# Altium project STM32MINI.PrjPcb
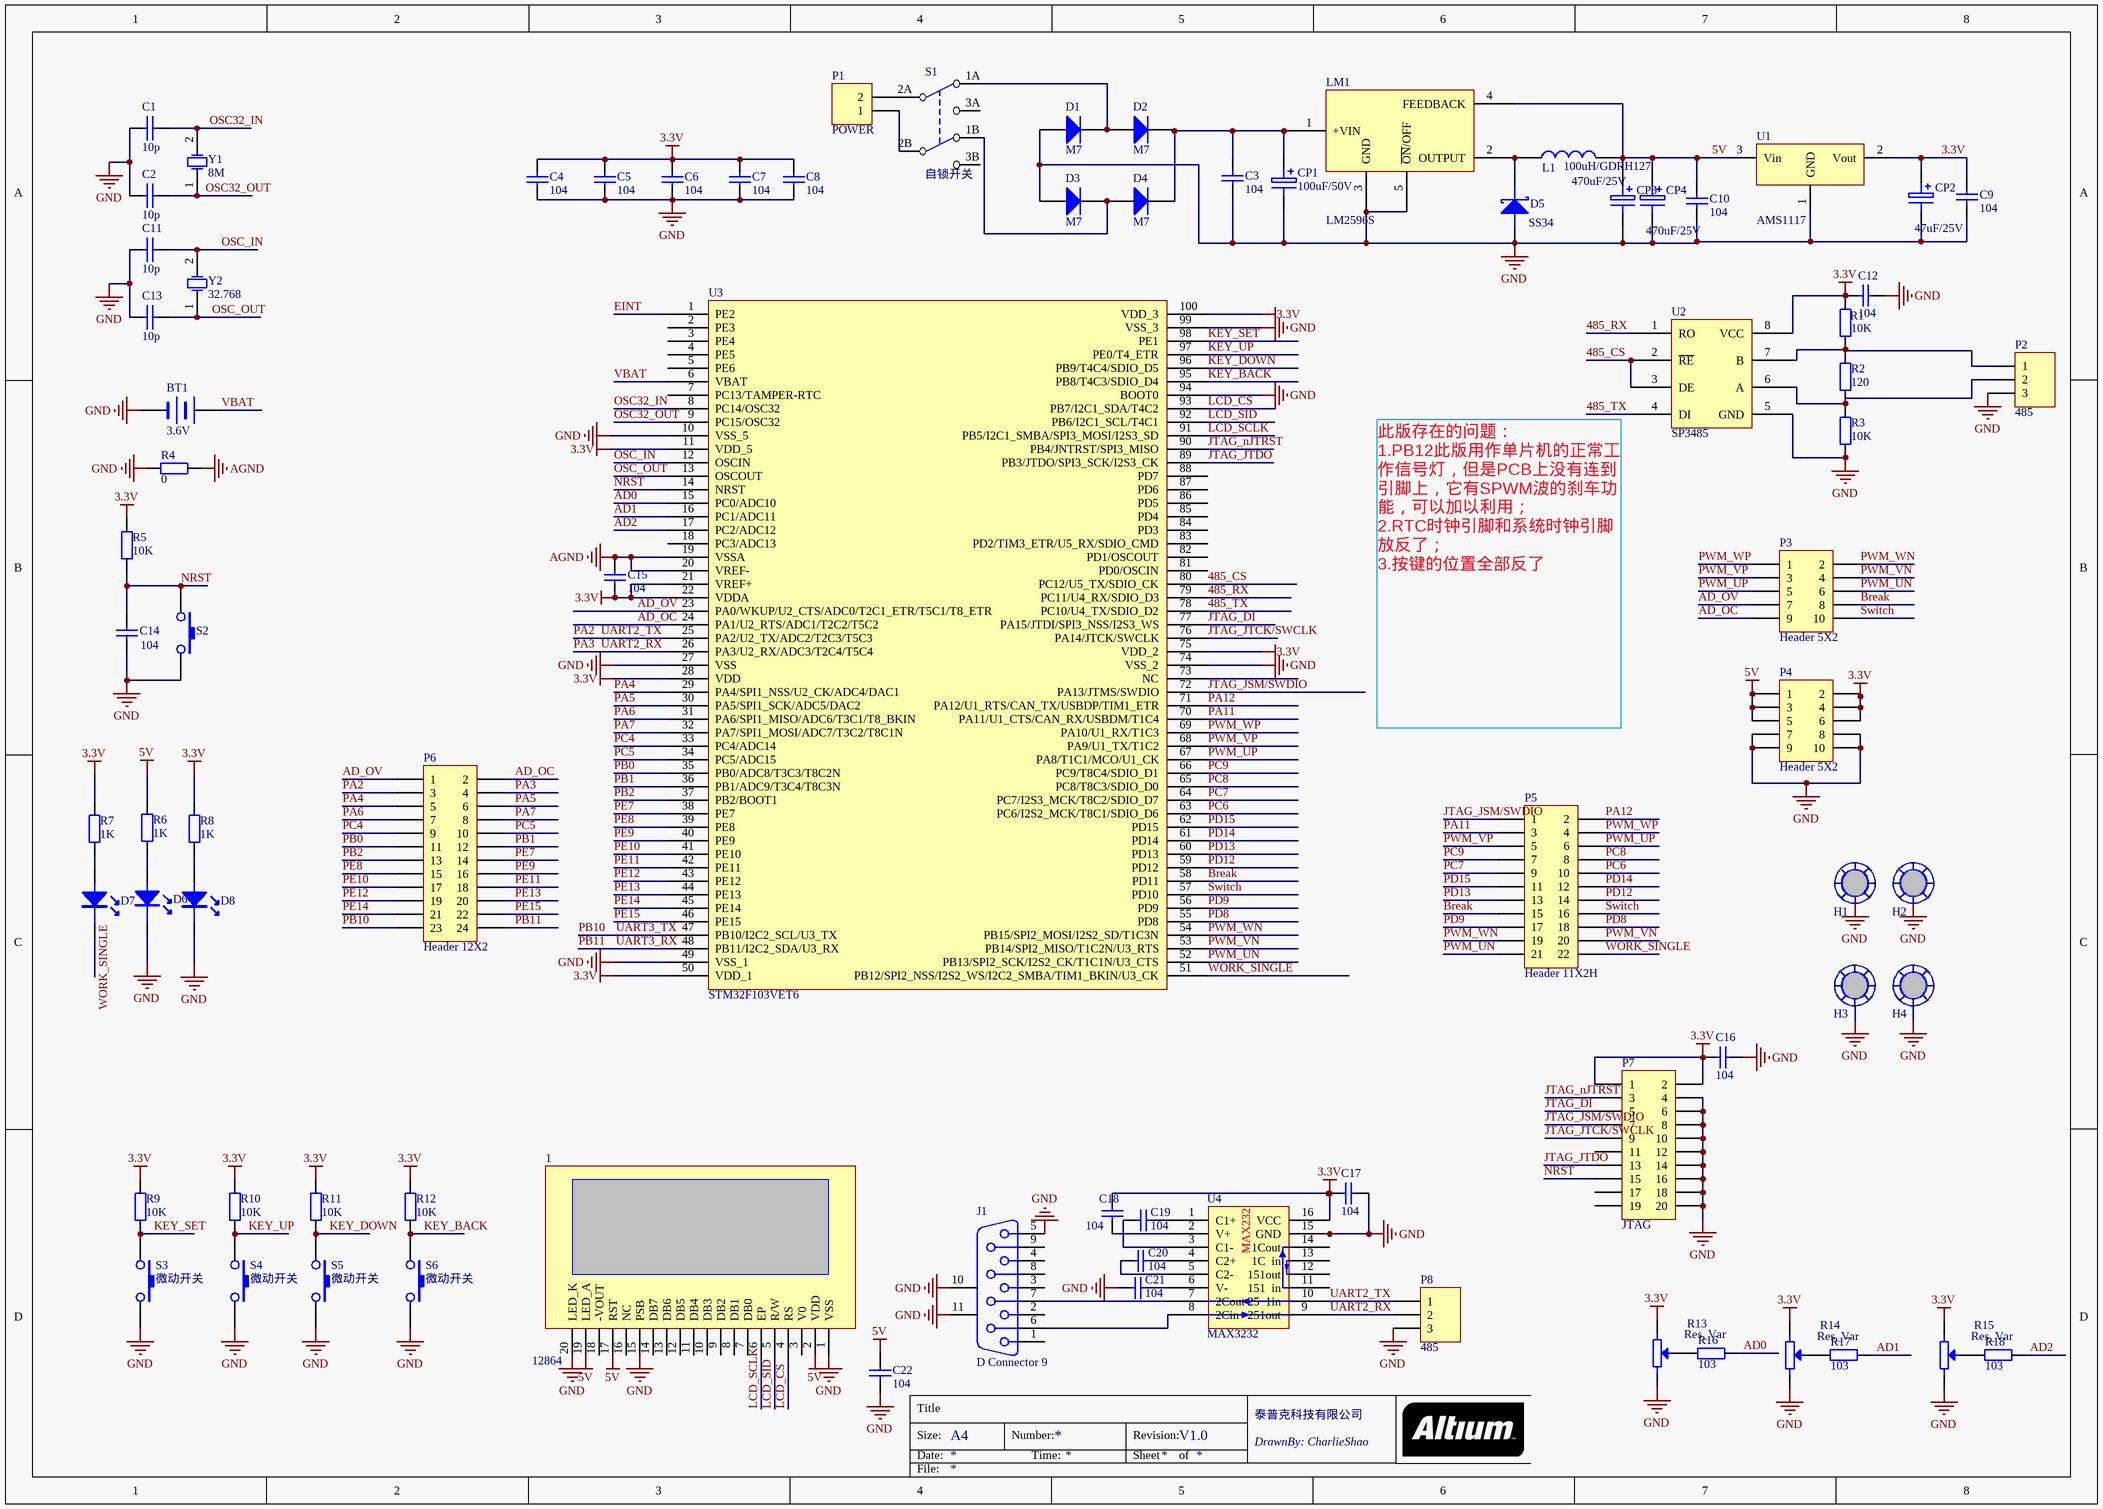
[diagram p0: MCU外围电路.SchDoc]
1 sheet, 81 parts. Net scope: global (net labels, ports and power ports of the same name join across sheets).
Board file: STM32MINI.PcbDoc

## Sheet MCU外围电路.SchDoc
size A3; Address1: 泰普克科技有限公司; Address3: DrawnBy: CharlieShao; Revision: V1.0; ProjectName: BPQ

### Parts
1  12864  [YX12864B]
BT1  3.6V  [CR1220]
C1  10p  [0805C]
C2  10p  [0805C]
C3  104  [0805C]
C4  104  [0805C]
C5  104  [0805C]
C6  104  [0805C]
C7  104  [0805C]
C8  104  [0805C]
C9  104  [0805C]
C10  104  [0805C]
C11  10p  [0805C]
C12  104  [0805C]
C13  10p  [0805C]
C14  104  [0805C]
C15  104  [0805C]
C16  104  [0805C]
C17  104  [0805C]
C18  104  [0805C]
C19  104  [0805C]
C20  104  [0805C]
C21  104  [0805C]
C22  104  [0805C]
CP1  100uF/50V  [CAP_8X105]
CP2  47uF/25V  [CAP_6.3X5.4]
CP3  470uF/25V  [CAP_10X105]
CP4  470uF/25V  [CAP_10X105]
D1  M7  [SMA]
D2  M7  [SMA]
D3  M7  [SMA]
D4  M7  [SMA]
D5  SS34  [SMC]
D6  LED  [LED_0805]  (value not drawn)
D7  LED  [LED_0805]  (value not drawn)
D8  LED  [LED_0805]  (value not drawn)
H1  铜柱孔  [HOLE]  (value not drawn)
H2  铜柱孔  [HOLE]  (value not drawn)
H3  铜柱孔  [HOLE]  (value not drawn)
H4  铜柱孔  [HOLE]  (value not drawn)
J1  D Connector 9  [DSUB1.385-2H9]
L1  100uH/GDRH127  [SMDRH124/125/127]
LM1  LM2596S  [TO-263S]
P1  POWER  [3.81-2]
P2  485  [SIP3]
P3  Header 5X2  [HDR2X5]
P4  Header 5X2  [HDR2X5]
P5  Header 11X2H  [HDR2X11]
P6  Header 12X2  [HDR2X12]
P7  JTAG  [JTAG20]
P8  485  [SIP3]
R1  10K  [0805R]
R2  120  [0805R]
R3  10K  [0805R]
R4  0  [0805R]
R5  10K  [0805R]
R6  1K  [0805R]
R7  1K  [0805R]
R8  1K  [0805R]
R9  10K  [0805R]
R10  10K  [0805R]
R11  10K  [0805R]
R12  10K  [0805R]
R13  Res_Var  [VR1]
R14  Res_Var  [VR1]
R15  Res_Var  [VR1]
R16  103  [0805R]
R17  103  [0805R]
R18  103  [0805R]
S1  自锁开关  [自锁开关]
S2  KEY  [SW_PB - 6.5x4.5]  (value not drawn)
S3  微动开关  [SW_PB - 6.5x4.5]
S4  微动开关  [SW_PB - 6.5x4.5]
S5  微动开关  [SW_PB - 6.5x4.5]
S6  微动开关  [SW_PB - 6.5x4.5]
U1  AMS1117  [SOT223]
U2  SP3485  [SO-8]
U3  STM32F103VET6  [LQFP100]
U4  MAX3232  [SO-16]
Y1  8M  [XTAL2]
Y2  32.768  [XTAL1]

### Nets
3.3V: C4.1 C5.1 C6.1 C7.1 C8.1 C9.1 C12.1 C15.2 C16.1 C17.2 C18.2 CP2.1 P4.2 P4.4 P4.6 P7.1 P7.2 R1.2 R5.2 R7.1 R8.1 R9.2 R10.2 R11.2 R12.2 R13.1 R14.1 R15.1 U1.2(Vout) U2.8(VCC) U3.11(VDD_5) U3.21(VREF+) U3.22(VDDA) U3.28(VDD) U3.50(VDD_1) U3.75(VDD_2) U3.100(VDD_3) U4.16(VCC)
5V: 1.2(VDD) 1.17(RST) 1.19(LED_A) C10.1 C22.2 CP3.1 CP4.1 L1.2 LM1.4(FEEDBACK) P4.1 P4.3 P4.5 R6.1 U1.3(Vin)
AGND: C15.1 R4.1 U3.19(VSSA) U3.20(VREF-)
GND: 1.1(VSS) 1.15(PSB) 1.20(LED_K) BT1.2(-) C1.1 C2.1 C3.2 C4.2 C5.2 C6.2 C7.2 C8.2 C9.2 C10.2 C11.1 C12.2 C13.1 C14.1 C16.2 C17.1 C21.2 C22.1 CP1.2 CP2.2 CP3.2 CP4.2 D1.1(A) D3.1(A) D5.1(A) D6.2 D8.2 H1.0 H2.0 H3.0 H4.0 J1.5 J1.10(MH1) J1.11(MH2) LM1.3(GND) LM1.5(~{ON}/OFF) P2.3 P4.7 P4.8 P4.9 P4.10 P7.4 P7.6 P7.8 P7.10 P7.12 P7.14 P7.16 P7.18 P7.20 P8.3 R3.1 R4.2 R13.3 R14.3 R15.3 S2.2 S3.2 S4.2 S5.2 S6.2 U1.1(GND) U2.5(GND) U3.10(VSS_5) U3.27(VSS) U3.49(VSS_1) U3.74(VSS_2) U3.94(BOOT0) U3.99(VSS_3) U4.15(GND)
485_CS: U2.2(~{RE}) U2.3(DE) U3.80(PC12/U5_TX/SDIO_CK)
485_RX: U2.1(RO) U3.79(PC11/U4_RX/SDIO_D3)
485_TX: U2.4(DI) U3.78(PC10/U4_TX/SDIO_D2)
AD0: R16.1 U3.15(PC0/ADC10)
AD1: R17.1 U3.16(PC1/ADC11)
AD2: R18.1 U3.17(PC2/ADC12)
AD_OC: P3.9 P6.2 U3.24(PA1/U2_RTS/ADC1/T2C2/T5C2)
AD_OV: P3.7 P6.1 U3.23(PA0/WKUP/U2_CTS/ADC0/T2C1_ETR/T5C1/T8_ETR)
Break: P3.8 P5.15 U3.58(PD11)
EINT: U3.1(PE2)
JTAG_DI: P7.5 U3.77(PA15/JTDI/SPI3_NSS/I2S3_WS)
JTAG_JSM/SWDIO: P5.1 P7.7 U3.72(PA13/JTMS/SWDIO)
JTAG_JTCK/SWCLK: P7.9 U3.76(PA14/JTCK/SWCLK)
JTAG_JTDO: P7.13 U3.89(PB3/JTDO/SPI3_SCK/I2S3_CK)
JTAG_nJTRST: P7.3 U3.90(PB4/JNTRST/SPI3_MISO)
KEY_BACK: R12.1 S6.1 U3.95(PB8/T4C3/SDIO_D4)
KEY_DOWN: R11.1 S5.1 U3.96(PB9/T4C4/SDIO_D5)
KEY_SET: R9.1 S3.1 U3.98(PE1)
KEY_UP: R10.1 S4.1 U3.97(PE0/T4_ETR)
LCD_CS: 1.4(RS) U3.93(PB7/I2C1_SDA/T4C2)
LCD_SCLK: 1.6(EP) U3.91(PB5/I2C1_SMBA/SPI3_MOSI/I2S3_SD)
LCD_SID: 1.5(R/W) U3.92(PB6/I2C1_SCL/T4C1)
NRST: C14.2 P7.15 R5.1 S2.1 U3.14(NRST)
OSC32_IN: C1.2 U3.8(PC14/OSC32) Y1.2(OSC2)
OSC32_OUT: C2.2 U3.9(PC15/OSC32) Y1.1(OSC1)
OSC_IN: C11.2 U3.12(OSCIN) Y2.2(OSC2)
OSC_OUT: C13.2 U3.13(OSCOUT) Y2.1(OSC1)
PA2: P6.3 P8.1 U3.25(PA2/U2_TX/ADC2/T2C3/T5C3) U4.10(25__1in)  [also labelled UART2_TX]
PA3: P6.4 P8.2 U3.26(PA3/U2_RX/ADC3/T2C4/T5C4) U4.9(251out)  [also labelled UART2_RX]
PA4: P6.5 U3.29(PA4/SPI1_NSS/U2_CK/ADC4/DAC1)
PA5: P6.6 U3.30(PA5/SPI1_SCK/ADC5/DAC2)
PA6: P6.7 U3.31(PA6/SPI1_MISO/ADC6/T3C1/T8_BKIN)
PA7: P6.8 U3.32(PA7/SPI1_MOSI/ADC7/T3C2/T8C1N)
PA11: P5.3 U3.70(PA11/U1_CTS/CAN_RX/USBDM/T1C4)
PA12: P5.2 U3.71(PA12/U1_RTS/CAN_TX/USBDP/TIM1_ETR)
PB0: P6.11 U3.35(PB0/ADC8/T3C3/T8C2N)
PB1: P6.12 U3.36(PB1/ADC9/T3C4/T8C3N)
PB2: P6.13 U3.37(PB2/BOOT1)
PB10: P6.23 U3.47(PB10/I2C2_SCL/U3_TX)  [also labelled UART3_TX]
PB11: P6.24 U3.48(PB11/I2C2_SDA/U3_RX)  [also labelled UART3_RX]
PC4: P6.9 U3.33(PC4/ADC14)
PC5: P6.10 U3.34(PC5/ADC15)
PC6: P5.10 U3.63(PC6/I2S2_MCK/T8C1/SDIO_D6)
PC7: P5.9 U3.64(PC7/I2S3_MCK/T8C2/SDIO_D7)
PC8: P5.8 U3.65(PC8/T8C3/SDIO_D0)
PC9: P5.7 U3.66(PC9/T8C4/SDIO_D1)
PD8: P5.18 U3.55(PD8)
PD9: P5.17 U3.56(PD9)
PD12: P5.14 U3.59(PD12)
PD13: P5.13 U3.60(PD13)
PD14: P5.12 U3.61(PD14)
PD15: P5.11 U3.62(PD15)
PE7: P6.14 U3.38(PE7)
PE8: P6.15 U3.39(PE8)
PE9: P6.16 U3.40(PE9)
PE10: P6.17 U3.41(PE10)
PE11: P6.18 U3.42(PE11)
PE12: P6.19 U3.43(PE12)
PE13: P6.20 U3.44(PE13)
PE14: P6.21 U3.45(PE14)
PE15: P6.22 U3.46(PE15)
PWM_UN: P3.6 P5.21 U3.52(PB13/SPI2_SCK/I2S2_CK/T1C1N/U3_CTS)
PWM_UP: P3.5 P5.6 U3.67(PA8/T1C1/MCO/U1_CK)
PWM_VN: P3.4 P5.20 U3.53(PB14/SPI2_MISO/T1C2N/U3_RTS)
PWM_VP: P3.3 P5.5 U3.68(PA9/U1_TX/T1C2)
PWM_WN: P3.2 P5.19 U3.54(PB15/SPI2_MOSI/I2S2_SD/T1C3N)
PWM_WP: P3.1 P5.4 U3.69(PA10/U1_RX/T1C3)
Switch: P3.10 P5.16 U3.57(PD10)
VBAT: BT1.1(+) U3.6(VBAT)
WORK_SINGLE: P5.22 U3.51(PB12/SPI2_NSS/I2S2_WS/I2C2_SMBA/TIM1_BKIN/U3_CK)
NetC3_1: C3.1 CP1.1 D2.2(K) D4.2(K) LM1.1(+VIN)
NetC18_1: C18.1 U4.2(V+)
NetC19_1: C19.1 U4.3(C1-)
NetC19_2: C19.2 U4.1(C1+)
NetC20_1: C20.1 U4.5(C2-)
NetC20_2: C20.2 U4.4(C2+)
NetC21_1: C21.1 U4.6(V-)
NetD1_2: D1.2(K) D2.1(A) S1.1A(NC1)
NetD3_2: D3.2(K) D4.1(A) S1.1B(NC2)
NetD5_2: D5.2(K) L1.1 LM1.2(OUTPUT)
NetD6_1: D6.1 R6.2
NetD7_1: D7.1 R7.2
NetD8_1: D8.1 R8.2
NetJ1_6: J1.6 U4.8(2Cin)
NetJ1_7: J1.7 U4.7(2Cout)
NetP1_1: P1.1 S1.2B(COMMON2)
NetP1_2: P1.2 S1.2A(COMMON1)
NetP2_1: P2.1 R1.1 R2.2 U2.7(B)
NetP2_2: P2.2 R2.1 R3.2 U2.6(A)
NetR13_2: R13.2(W) R16.2
NetR14_2: R14.2(W) R17.2
NetR15_2: R15.2(W) R18.2

Not connected (* = marked no-connect by the designer): 1 3(V0) 7(DB0) 8(DB1) 9(DB2) 10(DB3) 11(DB4) 12(DB5) 13(DB6) 14(DB7) 16(NC) 18(-VOUT); D7 2; J1 1 2 3 4 8 9; P7 11 17 19; S1 3A(NO1) 3B(NO2); U3 2(PE3) 3(PE4) 4(PE5) 5(PE6) 7(PC13/TAMPER-RTC) 18(PC3/ADC13) 73(NC) 81(PD0/OSCIN) 82(PD1/OSCOUT) 83(PD2/TIM3_ETR/U5_RX/SDIO_CMD) 84(PD3) 85(PD4) 86(PD5) 87(PD6) 88(PD7); U4 11(151__in) 12(151out) 13(1C__in) 14(1Cout)

### Notes on the sheet
- (near U2) 此版存在的问题：
  1.PB12此版用作单片机的正常工作信号灯，但是PCB上没有连到引脚上，它有SPWM波的刹车功能，可以加以利用；
  2.RTC时钟引脚和系统时钟引脚放反了；
  3.按键的位置全部反了
- Labels drawn without touching a wire or pin: WORK_SINGLE
- Title
- Size:
- Date:
- A4
- Number:
- Time:
- Revision:
- Sheet
- of
- File:

### Library data of the parts
BT1 = BATTERY: 3.6V纽扣电池
C1 C2 C11 C13 = Cap: 非极性电容
C3-C10 C12 C14-C22 = Cap: Capacitor; Published: 8-Jun-2000; LatestRevisionDate: 17-Jul-2002; LatestRevisionNote: Re-released for DXP Platform.; PackageReference: RAD-0.3; Publisher: Altium Limited; Value: 104
CP1-CP4 = Cap_Pol: 极性电容
D1-D4 = Diode: Default Diode; Published: 8-Jun-2000; LatestRevisionDate: 17-Jul-2002; LatestRevisionNote: Re-released for DXP Platform.; PackageVersion: Sep-1996; PackageReference: SMC; Publisher: Altium Limited; PackageDescription: DO-214-AB/SMC; 2 C-Bend Leads; Body 7.9 x 5.9 mm, inc. leads (LxW); Code_JEDEC: DO-214-AB
D5 = Diode_Schottky: 肖特基
J1 = D Connector 9: Receptacle Assembly, 9 Position, Right Angle; PackageDocument: O; Positions: 9; Published: 15-Jun-2001; LatestRevisionDate: 17-Jul-2002; LatestRevisionNote: Re-released for DXP Platform.; DatasheetDocument: 1-Sep-1999; PackageReference: 788750; Publisher: Altium Limited; Orientation: Right Angle; Gender: Receptacle
L1 = Inductor: 电感
P1 = Header 2: Header, 2-Pin; LatestRevisionDate: 17-Jul-2002; LatestRevisionNote: Re-released for DXP Platform.; Publisher: Altium Limited
P2 P8 = MHDR1X3: Header, 3-Pin; LatestRevisionDate: 17-Jul-2002; LatestRevisionNote: Re-released for DXP Platform.; Publisher: Altium Limited
P3 P4 = Header 5X2: Header, 5-Pin, Dual row; LatestRevisionDate: 17-Jul-2002; LatestRevisionNote: Re-released for DXP Platform.; Publisher: Altium Limited
P5 = Header 11X2H: Header, 11-Pin, Dual row, Right Angle; LatestRevisionDate: 17-Jul-2002; LatestRevisionNote: Re-released for DXP Platform.; Publisher: Altium Limited
P6 = Header 12X2: Header, 12-Pin, Dual row; LatestRevisionDate: 17-Jul-2002; LatestRevisionNote: Re-released for DXP Platform.; Publisher: Altium Limited
P7 = Header 10X2: Header, 10-Pin, Dual row; LatestRevisionDate: 17-Jul-2002; LatestRevisionNote: Re-released for DXP Platform.; Publisher: Altium Limited
R1 R3 R5-R12 = Res2: Resistor; Published: 8-Jun-2000; LatestRevisionDate: 17-Jul-2002; LatestRevisionNote: Re-released for DXP Platform.; PackageReference: AXIAL-0.4; Publisher: Altium Limited
  R1 R3 R5 R9-R12: Value: 10K
  R6-R8: Value: 1K
R2 R4 R16-R18 = Res2: Resistor; Value: 10K; Published: 8-Jun-2000; LatestRevisionDate: 17-Jul-2002; LatestRevisionNote: Re-released for DXP Platform.; PackageReference: AXIAL-0.4; Publisher: Altium Limited
R13-R15 = Res_Var: 可变电阻
U1 = AMS1117: 三端稳压器件
U2 = MAX485
U4 = MAX232
Y1 Y2 = XTAL: Crystal Oscillator; Published: 8-Jun-2000; LatestRevisionDate: 17-Jul-2002; LatestRevisionNote: Re-released for DXP Platform.; PackageReference: R38; Publisher: Altium Limited; PackageDescription: Crystal, Thru-Hole; 2 Leads; Body 3.1 x 8.2 mm (Dia.xH)